# Altium schematic sheet SD_proto.SchDoc
size A4
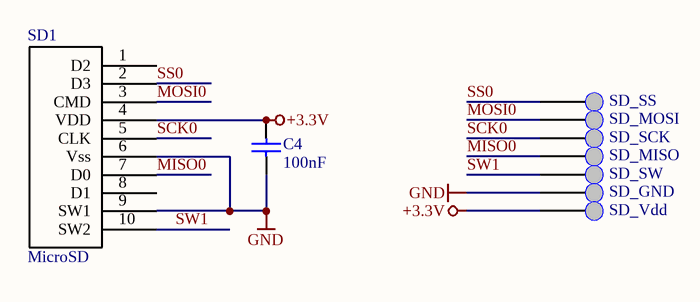
[diagram p0: SD_proto.SchDoc]

## Parts
C4  value 100nF  [0603]  (hidden comment: C0603)
SD1  MicroSD  [micro SD]
SD_GND  Testpoint  [En_pin_TP]  (value not drawn)
SD_MISO  Testpoint  [En_pin_TP]  (value not drawn)
SD_MOSI  Testpoint  [En_pin_TP]  (value not drawn)
SD_SCK  Testpoint  [En_pin_TP]  (value not drawn)
SD_SS  Testpoint  [En_pin_TP]  (value not drawn)
SD_SW  Testpoint  [En_pin_TP]  (value not drawn)
SD_Vdd  Testpoint  [En_pin_TP]  (value not drawn)

## Nets
+3.3V: C4.1 SD1.4(VDD) SD_Vdd.1
GND: C4.2 SD1.6(Vss) SD1.9(SW1) SD_GND.1
MISO0: SD1.7(D0) SD_MISO.1
MOSI0: SD1.3(CMD) SD_MOSI.1
SCK0: SD1.5(CLK) SD_SCK.1
SS0: SD1.2(D3) SD_SS.1
SW1: SD1.10(SW2) SD_SW.1

Not connected (* = marked no-connect by the designer): SD1 1(D2) 8(D1)

## Library data of the parts
C4 = C0603: Ceramic Chip Capacitor - Standard; Note: Footprint corresponds to dimensions for bulk cassette packaging. This case size has tightened tolerances.; Published: 17-Jul-2002; LatestRevisionDate: 19-Mar-2004; LatestRevisionNote: Silkscreen size reduced.; DatasheetDocument: Mar-2001; PackageDocument: Mar-2001; PackageReference: 0603; Publisher: Altium Limited; Code_JEITA: 0603; Code_IPC: 1608 [0603]; ComponentLink1Description: Manufacturer Link; ComponentLink1URL: http://www.kemet.com/; ComponentLink2Description: Datasheet; ComponentLink2URL: http://www.kemet.com/kemet/web/homepage/kechome.nsf/vapubfilesname/F3102TA.pdf/$file/F3102TA.pdf